# Altium project Soldering_station.PrjPcb
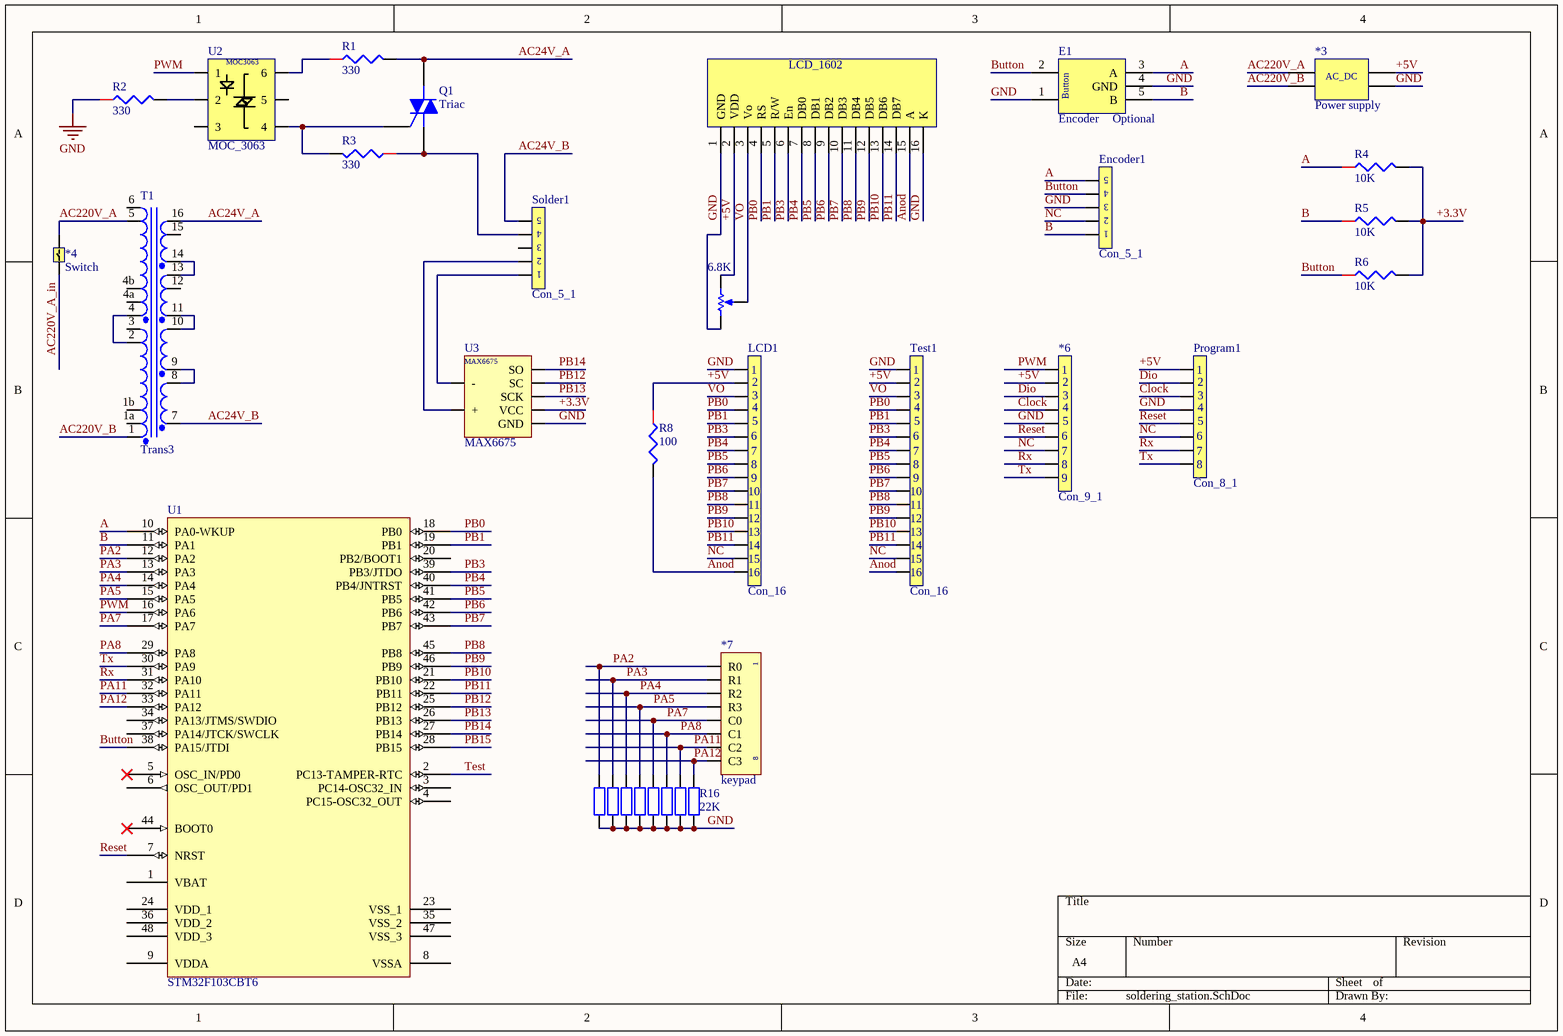
[diagram p0: soldering_station.SchDoc]
1 sheet, 32 parts. Net scope: global (net labels, ports and power ports of the same name join across sheets).

## Sheet soldering_station.SchDoc
size A4

### Parts
*2  LCD_1602  (value not drawn)
*3  Power supply
*4  Switch
*6  Con_9_1
*7  keypad
E1  Encoder
Encoder1  Con_5_1
LCD1  Con_16
Program1  Con_8_1
Q1  Triac  [369-03]
R1  330  [Chip2PinSM127P600-8N]
R2  330  [Chip2PinSM127P600-8N]
R3  330  [Chip2PinSM127P600-8N]
R4  10K  [Chip2PinSM127P600-8N]
R5  10K  [Chip2PinSM127P600-8N]
R6  10K  [Chip2PinSM127P600-8N]
R7  value 6.8K  [VR5]  (hidden comment: RPot)
R8  100  [Chip2PinSM127P600-8N]
R9  20K  [AXIAL-0.4]  (value not drawn)
R10  20K  [AXIAL-0.4]  (value not drawn)
R11  20K  [AXIAL-0.4]  (value not drawn)
R12  20K  [AXIAL-0.4]  (value not drawn)
R13  20K  [AXIAL-0.4]  (value not drawn)
R14  20K  [AXIAL-0.4]  (value not drawn)
R15  20K  [AXIAL-0.4]  (value not drawn)
R16  22K  [AXIAL-0.4]
Solder1  Con_5_1
T1  Trans3  [TRF_6]
Test1  Con_16
U1  STM32F103CBT6  [LQFP48_N]
U2  MOC_3063
U3  MAX6675

### Nets
GND: *2.1(GND) *2.16(K) *3.31 *6.5 E1.1 E1.4(GND) Encoder1.2 LCD1.1 Program1.4 R2.1 R7.1(TOP) R9.1 R10.1 R11.1 R12.1 R13.1 R14.1 R15.1 R16.1 Test1.1 U3.7(GND)
+3.3V: R4.2 R5.2 R6.2 U3.6(VCC)
+5V: *2.2(VDD) *3.30 *6.2 LCD1.2 Program1.1 R7.2(BOT) R8.1 Test1.2
A: E1.3(A) Encoder1.4 R4.1 U1.10(PA0-WKUP)
AC24V_A: Q1.2(M2) R1.2 T1.16
AC24V_B: Solder1.4 T1.7
AC220V_A: *3.32 *4.35 T1.5
AC220V_A_in: *4.34
AC220V_B: *3.33 T1.1
Anod: *2.15(A) LCD1.16 R8.2 Test1.16
B: E1.5(B) Encoder1.0 R5.1 U1.11(PA1)
Button: E1.2 Encoder1.3 R6.1 U1.38(PA15/JTDI)
Clock: *6.4 Program1.3
Dio: *6.3 Program1.2
NC: *6.7 Encoder1.1 LCD1.15 Program1.6 Test1.15
PA2: *7.1(R0) R9.2 U1.12(PA2)
PA3: *7.2(R1) R10.2 U1.13(PA3)
PA4: *7.3(R2) R11.2 U1.14(PA4)
PA5: *7.4(R3) R12.2 U1.15(PA5)
PA7: *7.5(C0) R13.2 U1.17(PA7)
PA8: *7.6(C1) R14.2 U1.29(PA8)
PA11: *7.7(C2) R15.2 U1.32(PA11)
PA12: *7.8(C3) R16.2 U1.33(PA12)
PB0: *2.4(RS) LCD1.4 Test1.4 U1.18(PB0)
PB1: *2.5(R/W) LCD1.5 Test1.5 U1.19(PB1)
PB3: *2.6(En) LCD1.6 Test1.6 U1.39(PB3/JTDO)
PB4: *2.7(DB0) LCD1.7 Test1.7 U1.40(PB4/JNTRST)
PB5: *2.8(DB1) LCD1.8 Test1.8 U1.41(PB5)
PB6: *2.9(DB2) LCD1.9 Test1.9 U1.42(PB6)
PB7: *2.10(DB3) LCD1.10 Test1.10 U1.43(PB7)
PB8: *2.11(DB4) LCD1.11 Test1.11 U1.45(PB8)
PB9: *2.12(DB5) LCD1.12 Test1.12 U1.46(PB9)
PB10: *2.13(DB6) LCD1.13 Test1.13 U1.21(PB10)
PB11: *2.14(DB7) LCD1.14 Test1.14 U1.22(PB11)
PB12: U1.25(PB12) U3.4(SC)
PB13: U1.26(PB13) U3.5(SCK)
PB14: U1.27(PB14) U3.3(SO)
PB15: U1.28(PB15)
PWM: *6.1 U1.16(PA6) U2.1
Reset: *6.6 Program1.5 U1.7(NRST)
Rx: *6.8 Program1.7 U1.31(PA10)
Test: U1.2(PC13-TAMPER-RTC)
Tx: *6.9 Program1.8 U1.30(PA9)
VO: *2.3(Vo) LCD1.3 R7.3(TAP) Test1.3
NetQ1_1: Q1.1(M1) R3.1 Solder1.3
NetQ1_3: Q1.3(G) R3.2 U2.4
NetR1_1: R1.1 U2.6
NetR2_2: R2.2 U2.2
NetSolder1_0: Solder1.0 U3.1(-)
NetSolder1_1: Solder1.1 U3.2(+)
NetT1_2: T1.2 T1.4
NetT1_8: T1.8 T1.9
NetT1_10: T1.10 T1.11
NetT1_13: T1.13 T1.14

Not connected (* = marked no-connect by the designer): Solder1 2; T1 1a 1b 3 4a 4b 6 12 15; U1 1(VBAT) 3(PC14-OSC32_IN) 4(PC15-OSC32_OUT) 5(OSC_IN/PD0)* 6(OSC_OUT/PD1) 8(VSSA) 9(VDDA) 20(PB2/BOOT1) 23(VSS_1) 24(VDD_1) 34(PA13/JTMS/SWDIO) 35(VSS_2) 36(VDD_2) 37(PA14/JTCK/SWCLK) 44(BOOT0)* 47(VSS_3) 48(VDD_3); U2 3 5

### Notes on the sheet
- (near E1) Optional
- (in symbol Con_5_1) 5
- (in symbol Encoder) Button
- (in symbol MOC_3065) MOC3063
- (in symbol Power supply) AC_DC

### Library data of the parts
*4 = Switch_3_small
Q1 = Triac: Silicon Bidirectional Triode Thyristor; Note: Pin 2 is electrically connected to Pin 4 (TAB); Published: 29-Sep-2000; LatestRevisionDate: 17-Jul-2002; LatestRevisionNote: Re-released for DXP Platform.; DatasheetVersion: 1999; PackageReference: 369-03; Publisher: Altium Limited; PackageDescription: TO, Thru-Hole, Vertical, Heatsink Mounted; 3 In-Line Leads; Pitch 2.28 mm; ComponentLink1Description: Manufacturer Link; ComponentLink1URL: http://www.motorola.com/
R1-R3 R8 = Resistor_1K: RES SMD 1K OHM 0.1% 1/10W 0603; Manufacturer Part Number: ERA-3AEB102V; Digi-Key Part Number: P1.0KDBCT-ND
R4-R6 = Resistor_10k Ohm: RES SMD 10K OHM 0.5% 1/16W 0603; Manufacturer Part Number: RR0816P-103-D; Digi-Key Part Number: RR08P10.0KDTR-ND
R7 = RPot: Potentiometer; Sim Note: Enter the Resistance value and the set point into parameter fields.; Set Position: 0.5; Published: 8-Jun-2000; LatestRevisionDate: 17-Jul-2002; LatestRevisionNote: Re-released for DXP Platform.; PackageReference: VR5; Publisher: Altium Limited; PackageDescription: Variable Resistor, Thru-Hole; 3 Leads
R9-R16 = Res2: Resistor; Footprint: 0805
T1 = Trans3_1: Three-winding Transformer (Non-Ideal); Sim Note: Enter the turns ratios, Core loss resistance, Magnetising Reactance, Leakage Reactances and Resistances referred to the primary side into the parameter fields.; Published: 25-Jan-2001; LatestRevisionDate: 17-Jul-2002; LatestRevisionNote: Re-released for DXP Platform.; PackageReference: TRF_6; Publisher: Altium Limited; PackageDescription: Transformer; 6 Leads
U1 = STM32F103CBT6: STM32 ARM-based 32-bit MCU with 128 Kbytes Flash, 48-pin LQFP, Industrial Temperature; Published: 30-May-2008; DatasheetVersion: rev6, Mar-2008; PackageVersion: Mar-2008; PackageReference: LQFP48; Publisher: Altium Limited; PackageDescription: 48-Pin Low-Profile Quad Flat Pack, 7 x 7 mm Body, 0.5 mm Pitch (LQFP48); ComponentLink1Description: Manufacturer Link; ComponentLink1URL: www.st.com/stm32; ComponentLink2Description: Datasheet; ComponentLink2URL: http://www.st.com/stonline/products/literature/ds/13587.pdf
U2 = MOC_3065